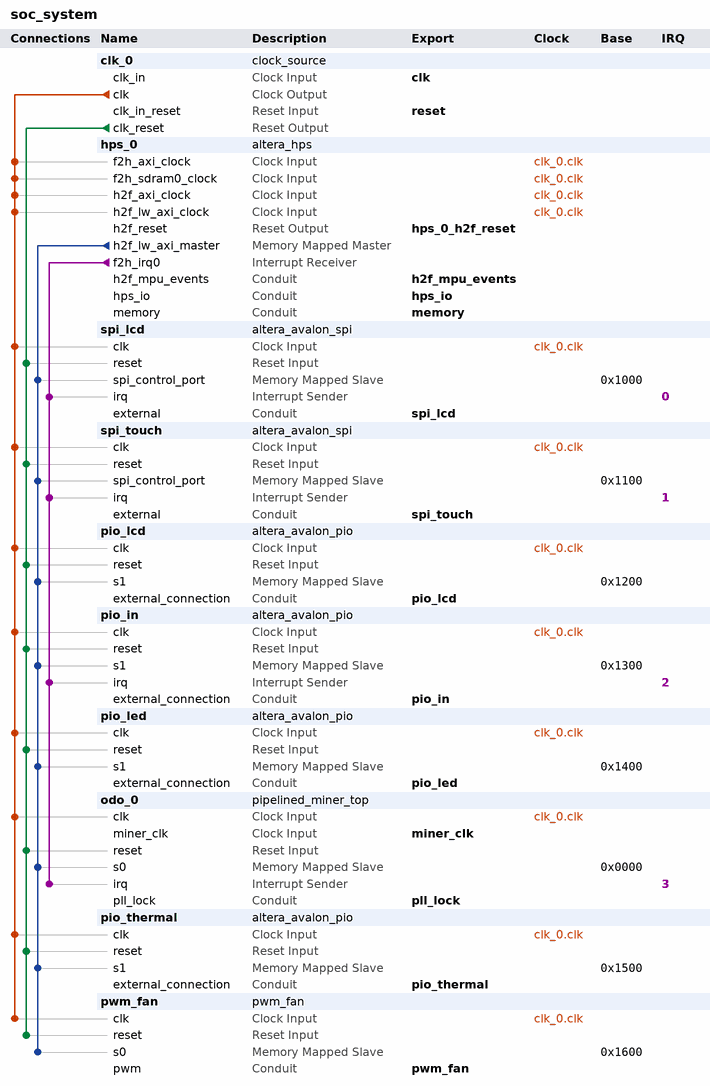
[diagram p0: system contents]
# Platform Designer (Qsys) system soc_system, Cyclone V 5CSXFC6C6U23I7
# Parameters at their usual value, and those the tool derives, are not listed.
package require -exact qsys 25.1
create_system soc_system
set_project_property DEVICE_FAMILY {Cyclone V}
set_project_property DEVICE 5CSXFC6C6U23I7

add_instance clk_0 clock_source 25.1
set_instance_parameter_value clk_0 clockFrequency 50000000

add_instance hps_0 altera_hps 25.1
set_instance_parameter_value hps_0 DEVICE_DEPTH 2
set_instance_parameter_value hps_0 EMAC1_Mode RGMII
set_instance_parameter_value hps_0 EMAC1_PinMuxing {HPS I/O Set 0}
set_instance_parameter_value hps_0 F2SCLK_COLDRST_Enable false
set_instance_parameter_value hps_0 F2SCLK_DBGRST_Enable false
set_instance_parameter_value hps_0 F2SCLK_WARMRST_Enable false
set_instance_parameter_value hps_0 F2SDRAM_Type AXI-3
set_instance_parameter_value hps_0 F2SDRAM_Width 64
set_instance_parameter_value hps_0 F2SINTERRUPT_Enable true
set_instance_parameter_value hps_0 F2S_Width 2
set_instance_parameter_value hps_0 FPGA_PERIPHERAL_OUTPUT_CLOCK_FREQ_EMAC0_GTX_CLK 125
set_instance_parameter_value hps_0 FPGA_PERIPHERAL_OUTPUT_CLOCK_FREQ_EMAC0_MD_CLK 2.5
set_instance_parameter_value hps_0 FPGA_PERIPHERAL_OUTPUT_CLOCK_FREQ_EMAC1_GTX_CLK 125
set_instance_parameter_value hps_0 FPGA_PERIPHERAL_OUTPUT_CLOCK_FREQ_EMAC1_MD_CLK 2.5
set_instance_parameter_value hps_0 HPS_PROTOCOL DDR3
set_instance_parameter_value hps_0 I2C0_Mode I2C
set_instance_parameter_value hps_0 I2C0_PinMuxing {HPS I/O Set 0}
set_instance_parameter_value hps_0 I2C1_Mode I2C
set_instance_parameter_value hps_0 I2C1_PinMuxing {HPS I/O Set 0}
set_instance_parameter_value hps_0 LWH2F_Enable true
set_instance_parameter_value hps_0 MEM_BANKADDR_WIDTH 3
set_instance_parameter_value hps_0 MEM_CLK_FREQ 300.0
set_instance_parameter_value hps_0 MEM_CLK_FREQ_MAX 400.0
set_instance_parameter_value hps_0 MEM_COL_ADDR_WIDTH 10
set_instance_parameter_value hps_0 MEM_DQ_WIDTH 32
set_instance_parameter_value hps_0 MEM_DRV_STR RZQ/6
set_instance_parameter_value hps_0 MEM_ROW_ADDR_WIDTH 14
set_instance_parameter_value hps_0 MEM_RTT_NOM RZQ/6
set_instance_parameter_value hps_0 MEM_RTT_WR {Dynamic ODT off}
set_instance_parameter_value hps_0 MEM_TCL 7
set_instance_parameter_value hps_0 MEM_TFAW_NS 37.5
set_instance_parameter_value hps_0 MEM_TINIT_US 499
set_instance_parameter_value hps_0 MEM_TMRD_CK 3
set_instance_parameter_value hps_0 MEM_TRAS_NS 40.0
set_instance_parameter_value hps_0 MEM_TRCD_NS 15.0
set_instance_parameter_value hps_0 MEM_TREFI_US 7.0
set_instance_parameter_value hps_0 MEM_TRFC_NS 75.0
set_instance_parameter_value hps_0 MEM_TRP_NS 15.0
set_instance_parameter_value hps_0 MEM_TWTR 2
set_instance_parameter_value hps_0 MEM_VENDOR JEDEC
set_instance_parameter_value hps_0 MEM_WTCL 6
set_instance_parameter_value hps_0 MPU_EVENTS_Enable true
set_instance_parameter_value hps_0 QSPI_Mode N/A
set_instance_parameter_value hps_0 QSPI_PinMuxing Unused
set_instance_parameter_value hps_0 REF_CLK_FREQ 125.0
set_instance_parameter_value hps_0 S2FCLK_USER2CLK 5
set_instance_parameter_value hps_0 S2F_Width 2
set_instance_parameter_value hps_0 SDIO_Mode {8-bit Data}
set_instance_parameter_value hps_0 SDIO_PinMuxing {HPS I/O Set 0}
set_instance_parameter_value hps_0 SPIM0_Mode {Single Slave Select}
set_instance_parameter_value hps_0 SPIM0_PinMuxing {HPS I/O Set 0}
set_instance_parameter_value hps_0 SPIM1_Mode N/A
set_instance_parameter_value hps_0 SPIM1_PinMuxing Unused
set_instance_parameter_value hps_0 STM_Enable false
set_instance_parameter_value hps_0 TIMING_BOARD_AC_SKEW 0.02
set_instance_parameter_value hps_0 TIMING_BOARD_AC_TO_CK_SKEW 0.0
set_instance_parameter_value hps_0 TIMING_BOARD_DQ_TO_DQS_SKEW 0.0
set_instance_parameter_value hps_0 TIMING_BOARD_MAX_CK_DELAY 0.6
set_instance_parameter_value hps_0 TIMING_BOARD_MAX_DQS_DELAY 0.6
set_instance_parameter_value hps_0 TIMING_BOARD_SKEW_BETWEEN_DQS 0.02
set_instance_parameter_value hps_0 TIMING_BOARD_SKEW_CKDQS_DIMM_MAX 0.01
set_instance_parameter_value hps_0 TIMING_BOARD_SKEW_CKDQS_DIMM_MIN -0.01
set_instance_parameter_value hps_0 TIMING_BOARD_SKEW_WITHIN_DQS 0.02
set_instance_parameter_value hps_0 TIMING_TDH 125
set_instance_parameter_value hps_0 TIMING_TDQSCK 400
set_instance_parameter_value hps_0 TIMING_TDQSQ 120
set_instance_parameter_value hps_0 TIMING_TDS 50
set_instance_parameter_value hps_0 TIMING_TIH 250
set_instance_parameter_value hps_0 TIMING_TIS 175
set_instance_parameter_value hps_0 TIMING_TQSH 0.38
set_instance_parameter_value hps_0 UART0_Mode {No Flow Control}
set_instance_parameter_value hps_0 UART0_PinMuxing {HPS I/O Set 0}
set_instance_parameter_value hps_0 USB1_Mode SDR
set_instance_parameter_value hps_0 USB1_PinMuxing {HPS I/O Set 0}
set_instance_parameter_value hps_0 desired_cfg_clk_mhz 100.0
set_instance_parameter_value hps_0 desired_qspi_clk_mhz 400.0

add_instance spi_lcd altera_avalon_spi 25.1
set_instance_parameter_value spi_lcd clockPolarity 0
set_instance_parameter_value spi_lcd dataWidth 8
set_instance_parameter_value spi_lcd masterSPI true
set_instance_parameter_value spi_lcd numberOfSlaves 1
set_instance_parameter_value spi_lcd targetClockRate 25000000

add_instance spi_touch altera_avalon_spi 25.1
set_instance_parameter_value spi_touch clockPolarity 0
set_instance_parameter_value spi_touch dataWidth 8
set_instance_parameter_value spi_touch masterSPI true
set_instance_parameter_value spi_touch numberOfSlaves 1
set_instance_parameter_value spi_touch targetClockRate 2000000

add_instance pio_lcd altera_avalon_pio 25.1
set_instance_parameter_value pio_lcd direction Output
set_instance_parameter_value pio_lcd resetValue 2
set_instance_parameter_value pio_lcd width 3

add_instance pio_in altera_avalon_pio 25.1
set_instance_parameter_value pio_in captureEdge true
set_instance_parameter_value pio_in direction Input
set_instance_parameter_value pio_in edgeType FALLING
set_instance_parameter_value pio_in generateIRQ true
set_instance_parameter_value pio_in irqType EDGE
set_instance_parameter_value pio_in width 3

add_instance pio_led altera_avalon_pio 25.1
set_instance_parameter_value pio_led direction Output
set_instance_parameter_value pio_led width 8

add_instance odo_0 pipelined_miner_top 1.0

add_instance pio_thermal altera_avalon_pio 25.1
set_instance_parameter_value pio_thermal direction Bidir
set_instance_parameter_value pio_thermal width 3

add_instance pwm_fan pwm_fan 1.0

# connections
add_connection clk_0.clk hps_0.f2h_axi_clock clock
add_connection clk_0.clk hps_0.f2h_sdram0_clock clock
add_connection clk_0.clk hps_0.h2f_axi_clock clock
add_connection clk_0.clk hps_0.h2f_lw_axi_clock clock
add_connection clk_0.clk odo_0.clk clock
add_connection clk_0.clk pio_in.clk clock
add_connection clk_0.clk pio_lcd.clk clock
add_connection clk_0.clk pio_led.clk clock
add_connection clk_0.clk pio_thermal.clk clock
add_connection clk_0.clk pwm_fan.clk clock
add_connection clk_0.clk spi_lcd.clk clock
add_connection clk_0.clk spi_touch.clk clock
add_connection clk_0.clk_reset odo_0.reset reset
add_connection clk_0.clk_reset pio_in.reset reset
add_connection clk_0.clk_reset pio_lcd.reset reset
add_connection clk_0.clk_reset pio_led.reset reset
add_connection clk_0.clk_reset pio_thermal.reset reset
add_connection clk_0.clk_reset pwm_fan.reset reset
add_connection clk_0.clk_reset spi_lcd.reset reset
add_connection clk_0.clk_reset spi_touch.reset reset
add_connection hps_0.h2f_lw_axi_master odo_0.s0 avalon
set_connection_parameter_value hps_0.h2f_lw_axi_master/odo_0.s0 baseAddress 0x0000
add_connection hps_0.h2f_lw_axi_master pio_in.s1 avalon
set_connection_parameter_value hps_0.h2f_lw_axi_master/pio_in.s1 baseAddress 0x1300
add_connection hps_0.h2f_lw_axi_master pio_lcd.s1 avalon
set_connection_parameter_value hps_0.h2f_lw_axi_master/pio_lcd.s1 baseAddress 0x1200
add_connection hps_0.h2f_lw_axi_master pio_led.s1 avalon
set_connection_parameter_value hps_0.h2f_lw_axi_master/pio_led.s1 baseAddress 0x1400
add_connection hps_0.h2f_lw_axi_master pio_thermal.s1 avalon
set_connection_parameter_value hps_0.h2f_lw_axi_master/pio_thermal.s1 baseAddress 0x1500
add_connection hps_0.h2f_lw_axi_master pwm_fan.s0 avalon
set_connection_parameter_value hps_0.h2f_lw_axi_master/pwm_fan.s0 baseAddress 0x1600
add_connection hps_0.h2f_lw_axi_master spi_lcd.spi_control_port avalon
set_connection_parameter_value hps_0.h2f_lw_axi_master/spi_lcd.spi_control_port baseAddress 0x1000
add_connection hps_0.h2f_lw_axi_master spi_touch.spi_control_port avalon
set_connection_parameter_value hps_0.h2f_lw_axi_master/spi_touch.spi_control_port baseAddress 0x1100
add_connection hps_0.f2h_irq0 odo_0.irq interrupt
set_connection_parameter_value hps_0.f2h_irq0/odo_0.irq irqNumber 3
add_connection hps_0.f2h_irq0 pio_in.irq interrupt
set_connection_parameter_value hps_0.f2h_irq0/pio_in.irq irqNumber 2
add_connection hps_0.f2h_irq0 spi_lcd.irq interrupt
set_connection_parameter_value hps_0.f2h_irq0/spi_lcd.irq irqNumber 0
add_connection hps_0.f2h_irq0 spi_touch.irq interrupt
set_connection_parameter_value hps_0.f2h_irq0/spi_touch.irq irqNumber 1

# exported interfaces
add_interface clk clock sink
set_interface_property clk EXPORT_OF clk_0.clk_in
add_interface h2f_mpu_events conduit end
set_interface_property h2f_mpu_events EXPORT_OF hps_0.h2f_mpu_events
add_interface hps_0_h2f_reset reset source
set_interface_property hps_0_h2f_reset EXPORT_OF hps_0.h2f_reset
add_interface hps_io conduit end
set_interface_property hps_io EXPORT_OF hps_0.hps_io
add_interface memory conduit end
set_interface_property memory EXPORT_OF hps_0.memory
add_interface miner_clk clock sink
set_interface_property miner_clk EXPORT_OF odo_0.miner_clk
add_interface pio_in conduit end
set_interface_property pio_in EXPORT_OF pio_in.external_connection
add_interface pio_lcd conduit end
set_interface_property pio_lcd EXPORT_OF pio_lcd.external_connection
add_interface pio_led conduit end
set_interface_property pio_led EXPORT_OF pio_led.external_connection
add_interface pio_thermal conduit end
set_interface_property pio_thermal EXPORT_OF pio_thermal.external_connection
add_interface pll_lock conduit end
set_interface_property pll_lock EXPORT_OF odo_0.pll_lock
add_interface pwm_fan conduit end
set_interface_property pwm_fan EXPORT_OF pwm_fan.pwm
add_interface reset reset sink
set_interface_property reset EXPORT_OF clk_0.clk_in_reset
add_interface spi_lcd conduit end
set_interface_property spi_lcd EXPORT_OF spi_lcd.external
add_interface spi_touch conduit end
set_interface_property spi_touch EXPORT_OF spi_touch.external

set_interconnect_requirement {$system} qsys_mm.clockCrossingAdapter HANDSHAKE
set_interconnect_requirement {$system} qsys_mm.enableEccProtection FALSE
set_interconnect_requirement {$system} qsys_mm.insertDefaultSlave FALSE
set_interconnect_requirement {$system} qsys_mm.maxAdditionalLatency 1

save_system soc_system.qsys
